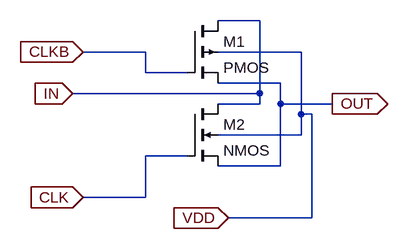
[diagram p0: schematic trGate.asc]
trGate.asc, the LTspice schematic file:
Version 4
SHEET 1 880 680
WIRE 304 224 240 224
WIRE 128 272 32 272
WIRE 368 272 240 272
WIRE 128 304 128 272
WIRE 192 304 128 304
WIRE 336 320 240 320
WIRE 304 336 304 224
WIRE 304 336 16 336
WIRE 304 352 304 336
WIRE 304 352 240 352
WIRE 336 352 336 320
WIRE 416 352 336 352
WIRE 368 368 368 272
WIRE 384 368 368 368
WIRE 368 400 368 368
WIRE 368 400 240 400
WIRE 192 432 128 432
WIRE 336 448 336 352
WIRE 336 448 240 448
WIRE 128 496 128 432
WIRE 128 496 32 496
WIRE 384 528 384 368
WIRE 384 528 256 528
FLAG 16 336 IN
IOPIN 16 336 In
FLAG 416 352 OUT
IOPIN 416 352 Out
FLAG 32 496 CLK
IOPIN 32 496 In
FLAG 32 272 CLKB
IOPIN 32 272 In
FLAG 256 528 VDD
IOPIN 256 528 In
SYMBOL pmos4 192 224 R0
SYMATTR InstName M1
SYMBOL nmos4 192 352 R0
SYMATTR InstName M2

The netlist it stands for:
* trGate.asc
M1 IN CLKB OUT VDD PMOS
M2 IN CLK OUT VDD NMOS
.model NMOS NMOS
.model PMOS PMOS
.lib standard.mos
.backanno
.end